# EAGLE design SunriseClockSplit (EAGLE 7.6.0)
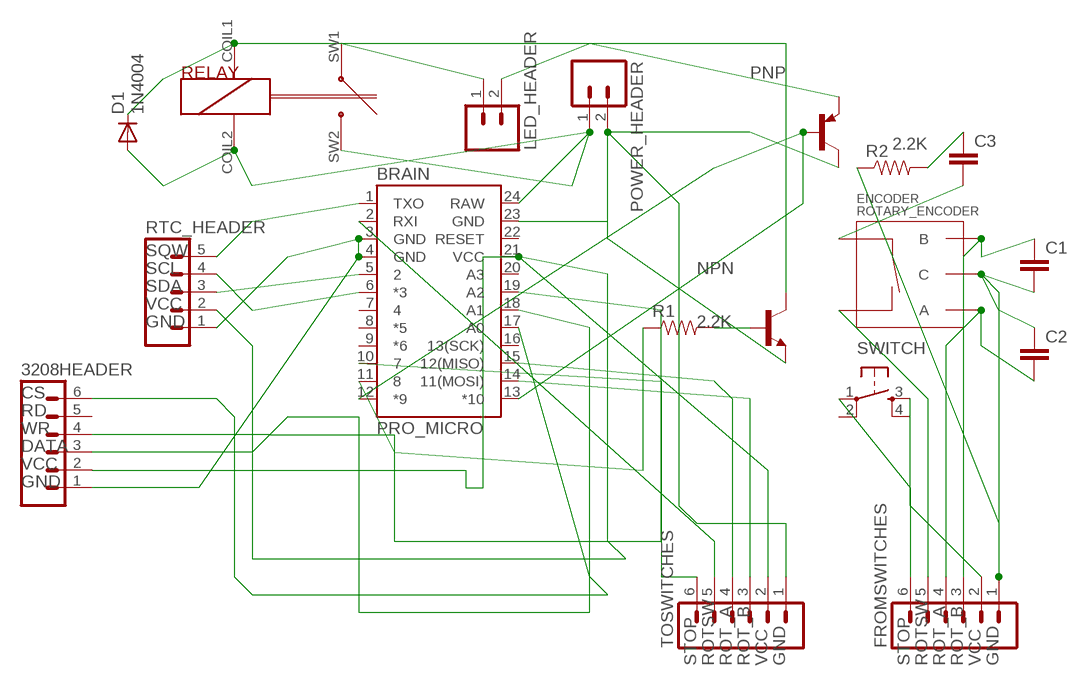
[diagram p0: schematic, sheet 1]

## Parts
3208HEADER  M06LOCK  [1X06_LOCK]
BRAIN  PRO_MICRO  ARDUINO_PRO_MICRO  [ARDUINO_PRO_MICRO]
C1  CAPEZ  [CAP-PTH-SMALLEZ]
C2  CAPEZ  [CAP-PTH-SMALLEZ]
C3  CAPEZ  [CAP-PTH-SMALLEZ]
D1  1N4004  [DO41-10]
ENCODER  ROTARY_ENCODER  ROTARTY_ENCODER  [ROTARY_ENC_PLAIN]
FROMSWITCHES  M06LOCK  [1X06_LOCK]
LED_HEADER  M02LOCK  [1X02_LOCK]
NPN  -NPN-TO126V  [TO126V]
PNP  -PNP-TO126V  [TO126V]
POWER_HEADER  M025MM  [SCREWTERMINAL-5MM-2]
R1  RESISTORPTH-1/4W  [AXIAL-0.4]
R2  RESISTORPTH-1/4W  [AXIAL-0.4]
RELAY  RELAY  BV-1254  [HALLER_RELAIS_2PIN]
RTC_HEADER  M05LOCK  [1X05_LOCK]
SWITCH  TAC_SWITCHPTH  [TACTILE-PTH]
TOSWITCHES  M06LOCK  [1X06_LOCK]

## Nets
N$1: BRAIN.24(RAW) D1.A POWER_HEADER.1 RELAY.COIL2 RELAY.SW2
N$2: LED_HEADER.1 RELAY.SW1
N$3: LED_HEADER.2 PNP.1(E)
N$4: FROMSWITCHES.6 SWITCH.1
N$5: BRAIN.12(*9) BRAIN.13(*10) PNP.3(B)
N$7: BRAIN.11 R1.P$1
N$8: NPN.3(B) R1.P$2
N$9: C1.1 ENCODER.B FROMSWITCHES.3
N$10: BRAIN.23(GND) NPN.1(E) PNP.2(C) POWER_HEADER.2 TOSWITCHES.1
N$11: C2.2 ENCODER.A FROMSWITCHES.4
N$12: C3.1 R2.P$2
N$13: C3.2 ENCODER.SW+
N$14: BRAIN.2(RXI) TOSWITCHES.5
N$15: BRAIN.10 TOSWITCHES.6
N$16: FROMSWITCHES.2 SWITCH.3
N$17: BRAIN.1(TXO) RTC_HEADER.5
N$18: C1.2 C2.1 ENCODER.C FROMSWITCHES.1 R2.P$1
N$19: 3208HEADER.2 BRAIN.21(VCC) RTC_HEADER.2 TOSWITCHES.2
N$20: BRAIN.6(*3) RTC_HEADER.4
N$21: BRAIN.5 RTC_HEADER.3
N$22: ENCODER.SW- FROMSWITCHES.5
N$23: 3208HEADER.1 BRAIN.3(GND) BRAIN.4(GND) RTC_HEADER.1
N$24: 3208HEADER.6 BRAIN.17(A0)
N$25: 3208HEADER.4 BRAIN.18(A1)
N$26: 3208HEADER.3 BRAIN.19(A2)
N$27: BRAIN.15(12(MISO)) TOSWITCHES.4
N$28: BRAIN.14(11(MOSI)) TOSWITCHES.3
N$29: D1.C NPN.2(C) RELAY.COIL1
Unconnected: 3208HEADER.5 BRAIN.7 BRAIN.8(*5) BRAIN.9(*6) BRAIN.16(13(SCK)) BRAIN.20(A3) BRAIN.22(RESET) SWITCH.2 SWITCH.4

## Library data of the parts
3208HEADER FROMSWITCHES TOSWITCHES = SparkFun-Connectors:M06: Header 6 Standard 6-pin 0.1" header. Use with straight break away headers (SKU : PRT-00116), right angle break away headers (PRT-00553), swiss pins (PRT-00743), machine pins (PRT-00117), and female headers (PRT-00115). Molex polarized connector foot print use with SKU : PRT-08094 with associated crimp pins and housings. NOTES ON THE VARIANTS LOCK and LOCK_LONGPADS... This footprint was designed to help hold the alignment of a through-hole component (i.e. 6-pin header) while soldering it into place. You may notice that each hole has been shifted either up or down by 0.005 of an inch from it's more standard position (which is a perfectly straight line). This slight alteration caused the pins (the squares in the middle) to touch the edges of the holes. Because they are alternating, it causes a "brace" to hold the component in place. 0.005 has proven to be the perfect amount of "off-center" position when using our standard breakaway headers. Although looks a little odd when you look at the bare footprint, once you have a header in there, the alteration is very hard to notice. Also,if you push a header all the way into place, it is covered up entirely on the bottom side. This idea of altering the position of holes to aid alignment will be further integrated into the Sparkfun Library for other footprints. It can help hold any component with 3 or more connection pins.
BRAIN = SparkFun-Boards:ARDUINO_PRO_MICRO
C1-C3 = SparkFun-Capacitors:CAP: Capacitor Standard 0603 ceramic capacitor, and 0.1" leaded capacitor.
D1 = diode:1N4004: DIODE general purpose rectifier, 1 A
ENCODER = SparkFun-Electromechanical:ROTARTY_ENCODER: Simple no LED rotary encoder Example: COM-09117
LED_HEADER = SparkFun-Connectors:M02: Standard 2-pin 0.1" header. Use with - straight break away headers ( PRT-00116) - right angle break away headers (PRT-00553) - swiss pins (PRT-00743) - machine pins (PRT-00117) - female headers (PRT-00115) Molex polarized connector foot print use with: PRT-08233 with associated crimp pins and housings. 2.54_SCREWTERM for use with PRT-10571. 3.5mm Screw Terminal footprints for PRT-08084 5mm Screw Terminal footprints for use with PRT-08432
NPN = transistor:*-NPN-: NPN Transistror BF959 corrected 2008.03.06
PNP = transistor:*-PNP-: PNP Transistror
POWER_HEADER = SparkFun-Connectors:M02: Standard 2-pin 0.1" header. Use with - straight break away headers ( PRT-00116) - right angle break away headers (PRT-00553) - swiss pins (PRT-00743) - machine pins (PRT-00117) - female headers (PRT-00115) Molex polarized connector foot print use with: PRT-08233 with associated crimp pins and housings. 2.54_SCREWTERM for use with PRT-10571. 3.5mm Screw Terminal footprints for PRT-08084 5mm Screw Terminal footprints for use with PRT-08432; STOREFRONT_ID: PRT-08432
R1 = SparkFun-Resistors:RESISTOR: Resistor Basic schematic elements and footprints for 0603, 1206, and PTH resistors.; R1: 2.2K
R2 = SparkFun-Resistors:RESISTOR: Resistor Basic schematic elements and footprints for 0603, 1206, and PTH resistors.; R2: 2.2K
RELAY = haller-relais:BV-1254
RTC_HEADER = SparkFun-Connectors:M05: Header 5 Standard 5-pin 0.1" header. Use with straight break away headers (SKU : PRT-00116), right angle break away headers (PRT-00553), swiss pins (PRT-00743), machine pins (PRT-00117), and female headers (PRT-00115). Molex polarized connector foot print use with SKU : PRT-08230 with associated crimp pins and housings.; GND: 1; SCL: 4; SDA: 3; SQW: 5; VCC: 2
SWITCH = SparkFun-Retired:TAC_SWITCH: Momentary Switch Button commonly used for reset or general input. Spark Fun Electronics SKU : COM-00097 SMT- SWCH-08247

## Board
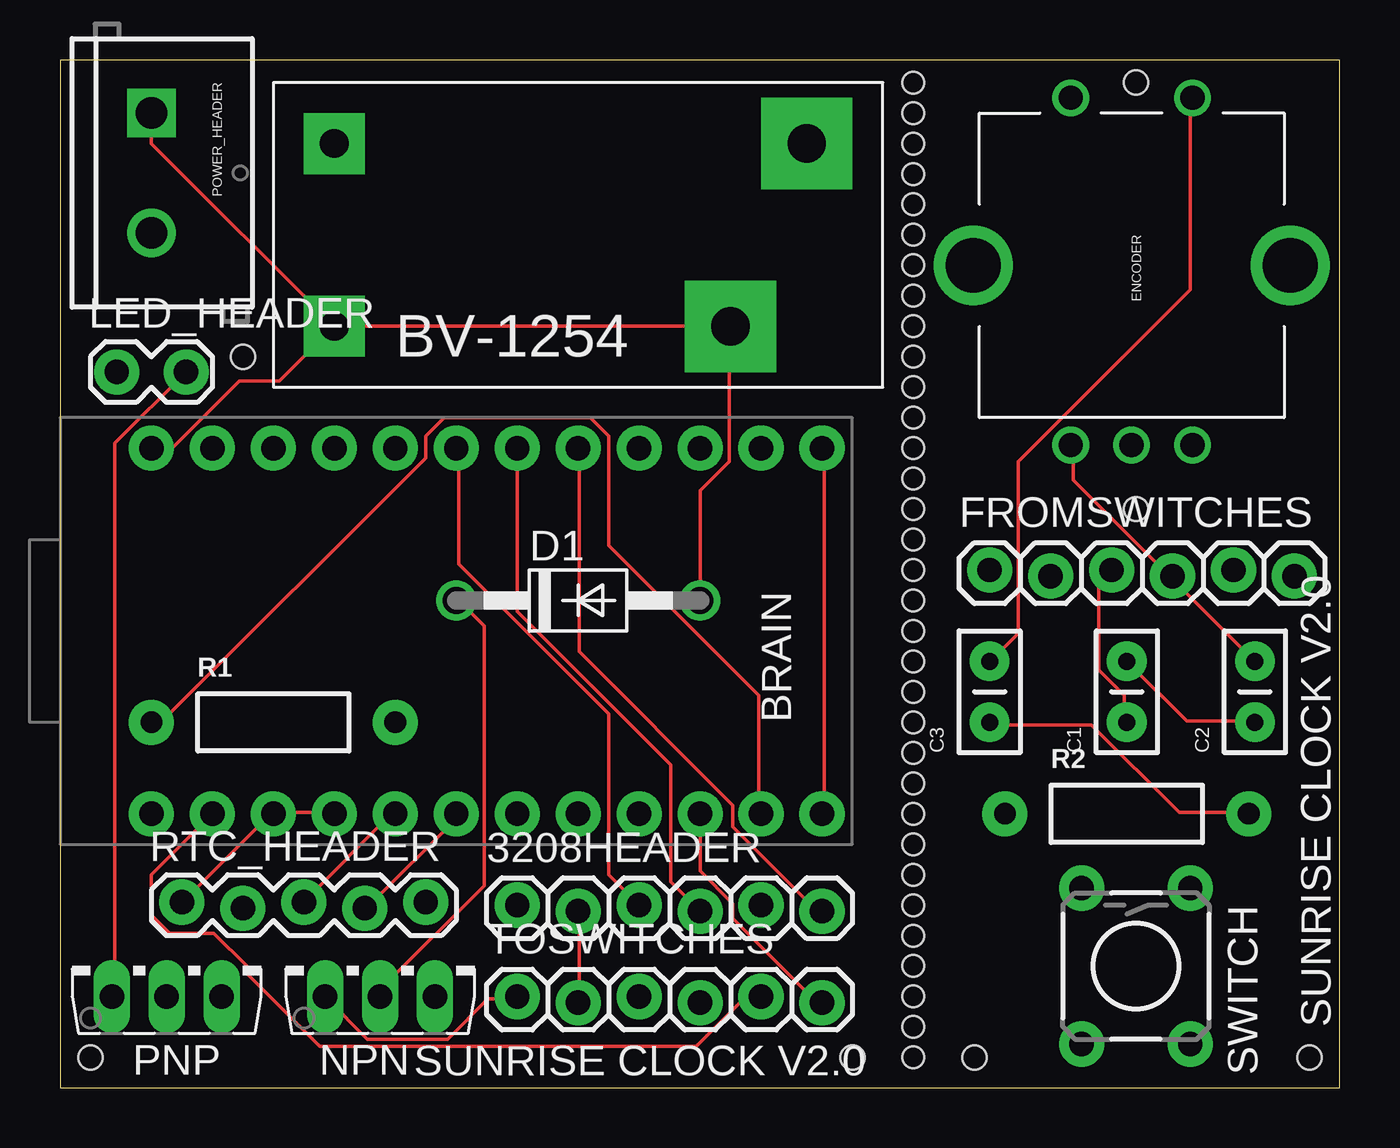
[diagram p1: board, top side]
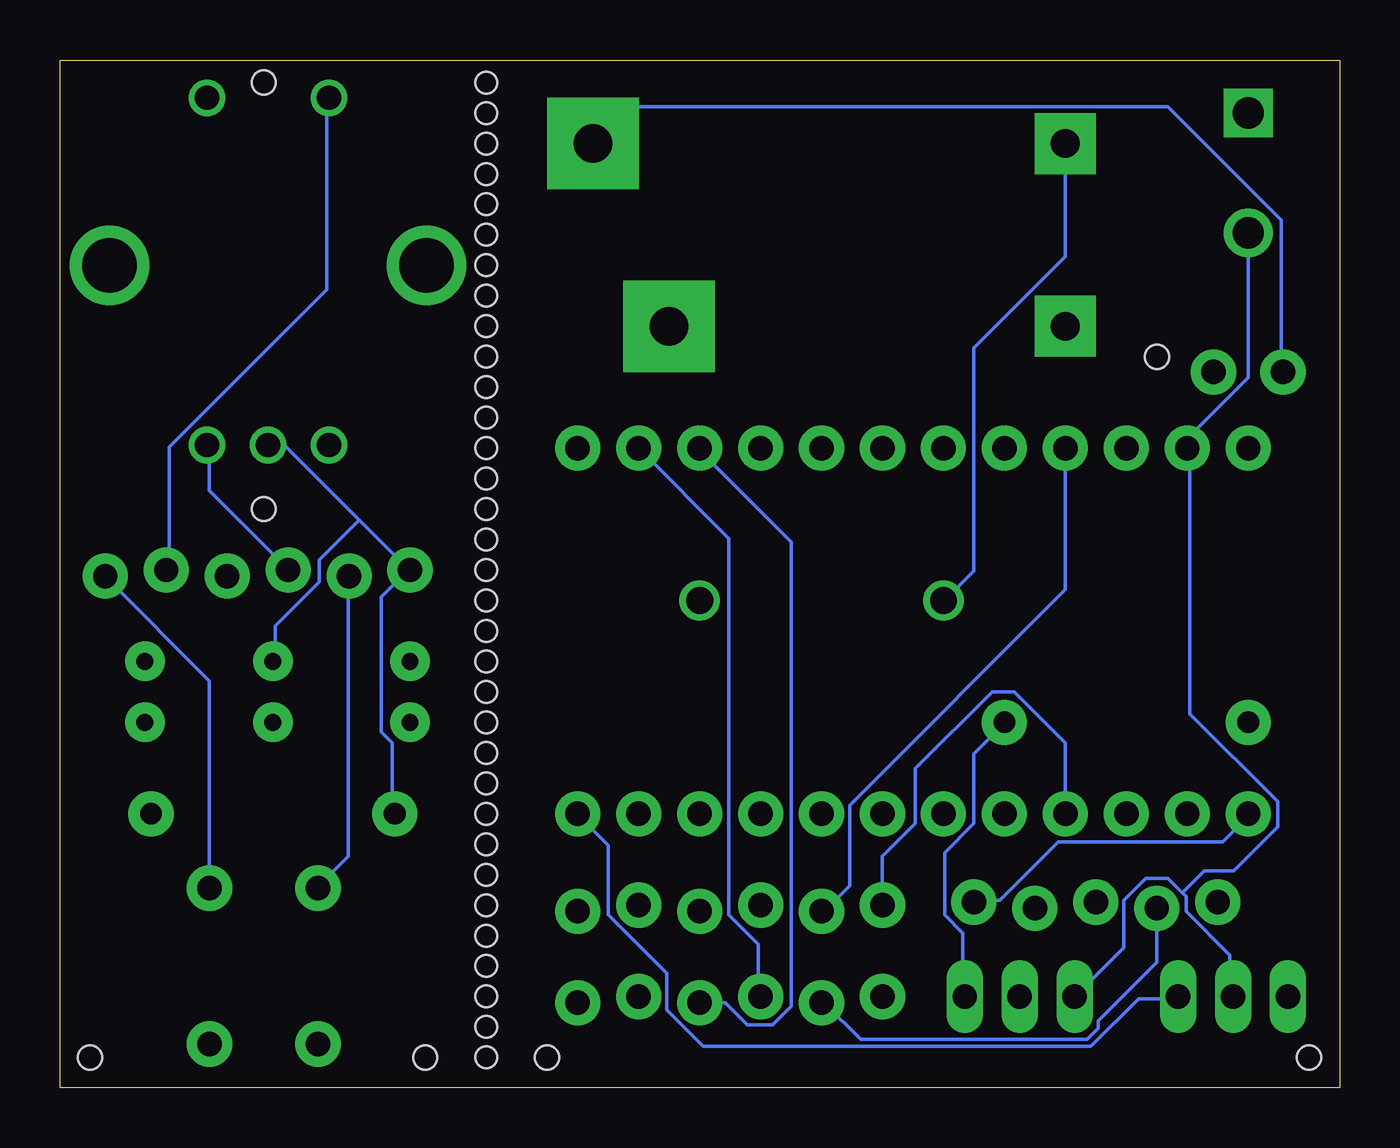
[diagram p2: board, bottom side, seen from below]

Size 53.32 x 42.85 mm. Coordinates in mm from the lower left corner, seen from the top.
Outline: 0,0 53.32,0 53.32,42.85 0,42.85 0,0
Copper layers (1*16): Top 0.0356mm / dielectric 1.5011mm / Bottom 0.0356mm
Design rules "oshpark-2layer": minimum track width 6mil, minimum drill 13mil, track to track 6mil, track to pad 6mil, pad to pad 6mil, via to via 6mil, smd to smd 6mil, copper to edge 15mil, drill to drill 6mil, minimum pad ring 7mil, minimum via ring 7mil, stop-mask expansion 2.5mil, vias tented up to drill 0mil, thermal gap 10mil
Holes 0.9 mm at 35.56,41.91 35.56,40.64 35.56,39.37 35.56,38.1 35.56,36.83 35.56,35.56 35.56,34.29 35.56,33.02 35.56,31.75 35.56,30.48 35.56,29.21 35.56,27.94 35.56,26.67 35.56,25.4 35.56,24.13 35.56,22.86 35.56,21.59 35.56,20.32 35.56,19.05 35.56,17.78 35.56,16.51 35.56,15.24 35.56,13.97 35.56,12.7 35.56,11.43 35.56,10.16 35.56,8.89 35.56,7.62 35.56,6.35 35.56,5.08 35.56,3.81 35.56,2.54 35.56,1.27
Holes 1 mm at 44.83,41.91 44.83,24.13 38.1,1.27 52.07,1.27 33.02,1.27 1.27,1.27 7.62,30.48

### Footprints (pad centres in the part's own frame; a part is rotated, then mirrored left to right if it is on the bottom)
1X06_LOCK = drill 1.016 pad 1.88: 1 0,0; 2 2.54,-0.254; 3 5.08,0; 4 7.62,-0.254; 5 10.16,0; 6 12.7,-0.254
ARDUINO_PRO_MICRO = drill 1.016 pad 1.88: 1 -7.62,12.7; 2 -7.62,10.16; 3 -7.62,7.62; 4 -7.62,5.08; 5 -7.62,2.54; 6 -7.62,0; 7 -7.62,-2.54; 8 -7.62,-5.08; 9 -7.62,-7.62; 10 -7.62,-10.16; 11 -7.62,-12.7; 12 -7.62,-15.24; 13 7.62,-15.24; 14 7.62,-12.7; 15 7.62,-10.16; 16 7.62,-7.62; 17 7.62,-5.08; 18 7.62,-2.54; 19 7.62,0; 20 7.62,2.54; 21 7.62,5.08; 22 7.62,7.62; 23 7.62,10.16; 24 7.62,12.7
CAP-PTH-SMALLEZ = drill 0.7 pad 1.651: 1 0,0; 2 2.54,0
DO41-10 = drill 1.118: A 5.08,0; C -5.08,0
ROTARY_ENC_PLAIN = drill 1.016: A 7.493,-2.54; B 7.493,2.54; C 7.493,0; SW+ -6.985,2.54; SW- -6.985,-2.54 | drill 2.286: P$3 0,6.604; P$4 0,-6.604
1X02_LOCK = drill 1.016 pad 1.88: 1 -0.178,0; 2 2.718,0
TO126V = drill 1.016 long: 1 -2.286,-1.27; 2 0,-1.27; 3 2.286,-1.27
SCREWTERMINAL-5MM-2 = drill 1.3 pad 2.032 square: 1 0,0 | drill 1.3 pad 2.032: 2 5,0
AXIAL-0.4 = drill 0.9 pad 1.88: P$1 -5.08,0; P$2 5.08,0
HALLER_RELAIS_2PIN = drill 1.2 pad 2.54 square: COIL1 -11.43,3.81; COIL2 -11.43,-3.81 | drill 1.6 pad 3.81 square: SW1 8.255,3.81; SW2 5.08,-3.81
1X05_LOCK = drill 1.016 pad 1.88: 1 0,0.127; 2 2.54,-0.127; 3 5.08,0.127; 4 7.62,-0.127; 5 10.16,0.127
TACTILE-PTH = drill 1.016 pad 1.88: 1 -3.251,2.261; 2 3.251,2.261; 3 -3.251,-2.261; 4 3.251,-2.261

### Placement (x,y rotation side)
3208HEADER  19.05,7.62 0 top
BRAIN  16.51,19.05 90 top
C1  44.45,15.24 90 top
C2  49.78,15.24 90 top
C3  38.73,15.24 90 top
D1  21.59,20.32 0 top
ENCODER  44.65,34.29 270 top
FROMSWITCHES  38.73,21.59 0 top
LED_HEADER  2.54,29.84 0 top
NPN  13.34,5.08 0 top
PNP  4.45,5.08 0 top
POWER_HEADER  3.81,40.64 270 top
R1  8.89,15.24 0 top
R2  44.45,11.43 0 top
RELAY  22.86,35.56 0 top
RTC_HEADER  5.08,7.62 0 top
SWITCH  44.83,5.08 270 top
TOSWITCHES  19.05,3.81 0 top

### Tracks (layer width: path | path; a pad name or v marks a point on that pad's centre or on a via)
N$1
  Top 0.152: D1.A 26.67,24.89 27.89,26.11 27.89,31.75 | RELAY.COIL2 9.14,29.46 7.47,29.46 4.72,26.72 3.81,26.72 BRAIN.24 | POWER_HEADER.1 3.81,39.37 RELAY.COIL2 | RELAY.COIL2 27.89,31.75 | 27.89,31.75 RELAY.SW2
N$2
  Bottom 0.152: LED_HEADER.1 2.44,29.92 2.44,36.17 7.16,40.89 29.57,40.89 31.09,39.37 RELAY.SW1
N$3
  Top 0.152: LED_HEADER.2 2.29,26.87 2.29,3.86 PNP.1
N$4
  Bottom 0.152: SWITCH.1 47.09,16.97 51.36,21.23 FROMSWITCHES.6
N$5
  Top 0.152: BRAIN.13 31.85,26.57 31.85,11.48 BRAIN.12
  Bottom 0.152: PNP.3 6.86,3.71 8.38,3.71 10.36,1.73 26.52,1.73 28.04,3.25 28.04,4.77 30.48,7.21 30.48,10.11 31.7,11.33 BRAIN.12
N$7
  Top 0.152: BRAIN.11 29.11,11.48 29.11,16.36 22.86,22.61 22.86,27.18 22.1,27.94 16,27.94 15.24,27.18 15.24,26.26 4.27,15.29 3.81,15.29 R1.P$1
N$8
  Bottom 0.152: NPN.3 15.7,3.86 15.7,6.45 16.46,7.21 16.46,9.8 15.24,11.02 15.24,13.92 14.02,15.14 R1.P$2
N$9
  Top 0.152: C1.1 44.35,15.29 44.35,16.36 43.28,17.42 43.28,21.08 43.74,21.54 FROMSWITCHES.3
  Bottom 0.152: ENCODER.B 47.09,26.72 47.09,24.89 43.89,21.69 FROMSWITCHES.3
N$10
  Top 0.152: TOSWITCHES.1 19.05,3.71 17.83,3.71 16.15,2.03 12.8,2.03 11.12,3.71 NPN.1
  Bottom 0.152: POWER_HEADER.2 3.81,29.62 6.25,27.18 6.25,26.72 BRAIN.23 6.25,26.57 6.25,15.6 2.59,11.94 2.59,10.87 4.42,9.04 5.64,9.04 6.55,8.13 | 6.55,8.13 7.16,8.74 8.08,8.74 8.99,7.82 8.99,5.84 10.97,3.86 NPN.1 | 6.55,8.13 6.4,7.98 6.4,7.37 4.57,5.54 4.57,3.86 PNP.2
N$11
  Top 0.152: 46.33,21.23 42.22,25.35 42.22,26.72 ENCODER.A | 46.33,21.23 C2.2 | 46.33,21.23 FROMSWITCHES.4
N$12
  Top 0.152: C3.1 38.86,15.14 42.98,15.14 46.63,11.48 49.53,11.48 R2.P$2
N$13
  Top 0.152: ENCODER.SW+ 47.09,41.2 47.09,33.27 39.93,26.11 39.93,18.95 38.86,17.88 C3.2
N$14
  Top 0.152: BRAIN.2 3.81,8.89 3.81,7.21 4.57,6.45 6.4,6.45 7.77,5.08 7.77,4.77 10.82,1.73 26.52,1.73 28.5,3.71 29.11,3.71 TOSWITCHES.5
N$15
  Top 0.152: BRAIN.10 26.67,9.04 28.04,7.67 28.04,7.06 31.55,3.56 TOSWITCHES.6
N$16
  Bottom 0.152: FROMSWITCHES.2 41.3,21.23 41.3,9.65 42.52,8.43 SWITCH.3
N$17
  Bottom 0.152: RTC_HEADER.5 15.24,7.82 14.17,7.82 11.73,10.26 4.88,10.26 3.81,11.33 BRAIN.1
N$18
  Top 0.152: C1.2 46.94,15.29 49.68,15.29 C2.1
  Bottom 0.152: 40.84,23.67 38.86,21.69 FROMSWITCHES.1 38.86,21.54 39.93,20.47 39.93,14.83 39.47,14.38 39.47,11.48 R2.P$1 | 40.84,23.67 43.89,26.72 44.65,26.72 ENCODER.C | 40.84,23.67 42.52,22 42.52,21.08 44.35,19.25 44.35,17.88 C1.2
N$19
  Top 0.152: TOSWITCHES.2 21.64,3.56 21.64,7.37 3208HEADER.2
  Bottom 0.152: RTC_HEADER.2 7.62,5.23 10.06,2.79 10.06,2.49 10.52,2.03 19.96,2.03 21.49,3.56 TOSWITCHES.2 | BRAIN.21 11.43,20.78 20.42,11.79 20.42,8.43 21.49,7.37 3208HEADER.2
N$20
  Top 0.152: RTC_HEADER.4 12.8,7.52 16.61,11.33 BRAIN.6
N$21
  Top 0.152: RTC_HEADER.3 10.21,7.82 13.87,11.48 BRAIN.5
N$22
  Bottom 0.152: ENCODER.SW- 42.22,41.2 42.22,33.27 48.77,26.72 48.77,21.69 FROMSWITCHES.5
N$23
  Top 0.152: RTC_HEADER.1 5.18,7.82 8.84,11.48 BRAIN.3 8.99,11.48 11.43,11.48 BRAIN.4
  Bottom 0.152: 3208HEADER.1 19.05,9.65 17.68,11.02 17.68,13.31 14.48,16.51 13.56,16.51 11.43,14.38 BRAIN.4
N$24
  Top 0.152: 3208HEADER.6 31.55,7.37 28.04,10.87 28.04,11.79 21.64,18.19 21.64,26.57 BRAIN.17
N$25
  Top 0.152: BRAIN.18 19.05,19.86 25.45,13.46 25.45,8.59 3208HEADER.4
N$26
  Top 0.152: 3208HEADER.3 22.86,8.89 22.86,15.6 16.61,21.84 16.61,26.57 BRAIN.19
N$27
  Bottom 0.152: TOSWITCHES.4 25.6,3.56 24.69,2.64 23.62,2.64 22.86,3.4 22.86,22.76 26.67,26.57 BRAIN.15
N$28
  Bottom 0.152: BRAIN.14 25.45,22.91 25.45,7.21 24.23,5.99 24.23,3.86 TOSWITCHES.3
N$29
  Top 0.152: NPN.2 13.41,3.86 13.41,4.17 17.68,8.43 17.68,19.25 16.61,20.32 D1.C
  Bottom 0.152: RELAY.COIL1 11.43,34.65 15.24,30.84 15.24,21.54 16.46,20.32 D1.C

### Text on the board
tNames: SUNRISE CLOCK V2.0 | SUNRISE CLOCK V2.0